# Altium schematic sheet Driver.SchDoc
size A4; SheetNumber: 1; SheetTotal: 3
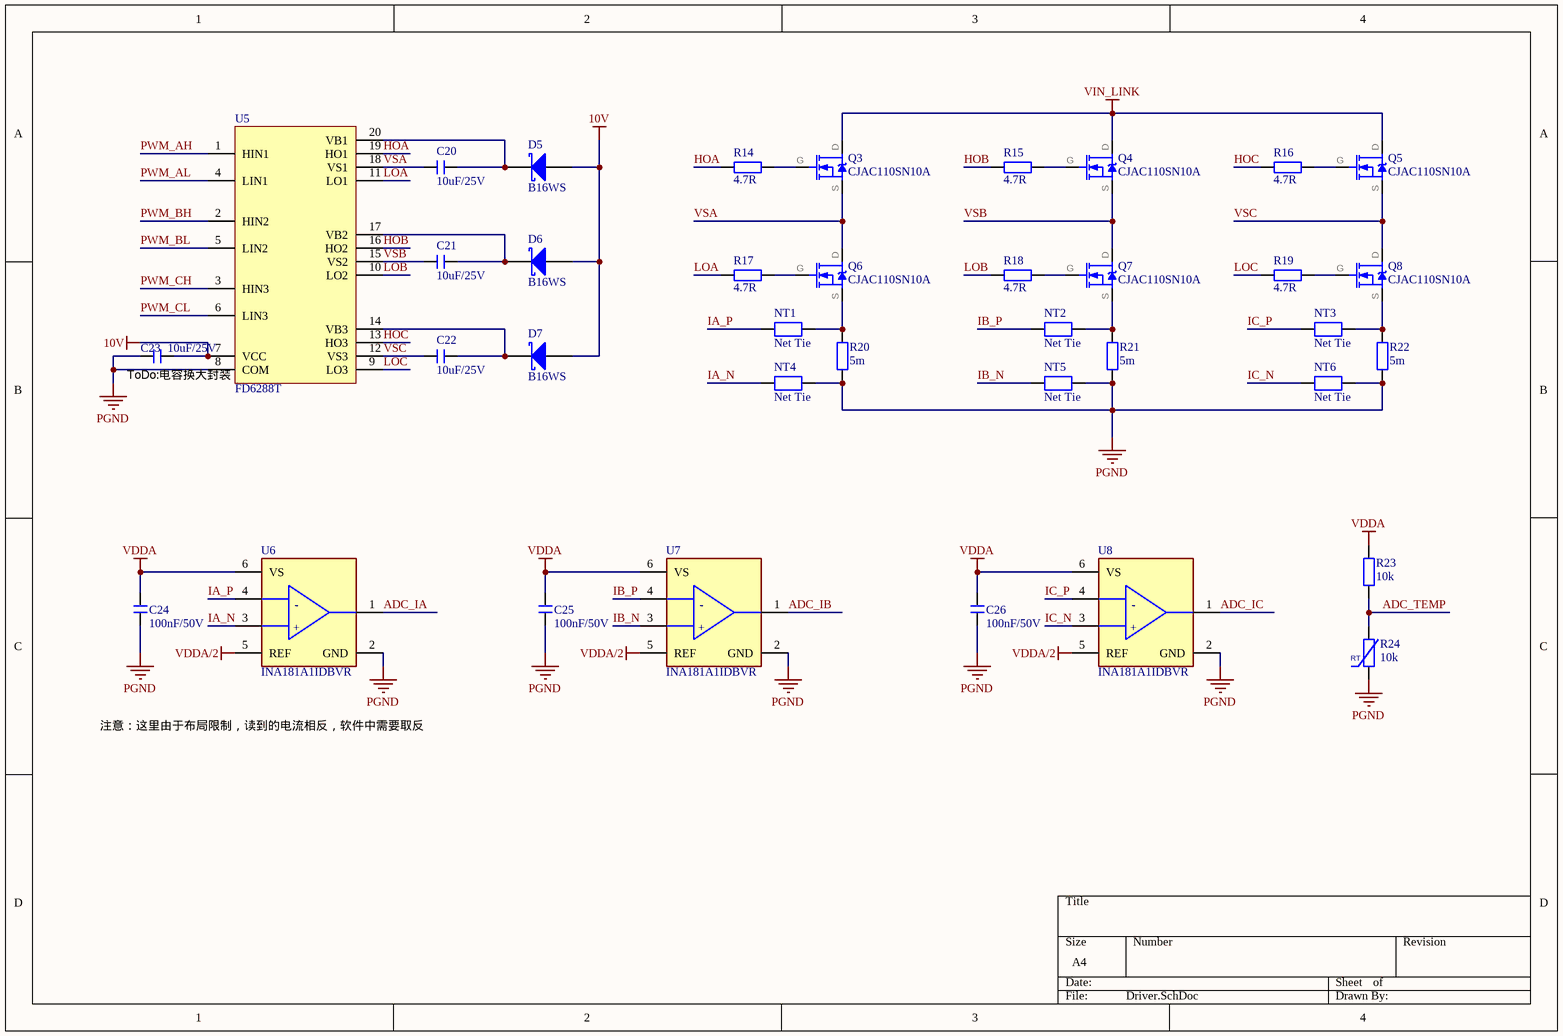
[diagram p0: Driver.SchDoc]

## Parts
C20  10uF/25V  [Capacitor_0603_SMD]
C21  10uF/25V  [Capacitor_0603_SMD]
C22  10uF/25V  [Capacitor_0603_SMD]
C23  10uF/25V  [Capacitor_0603_SMD]
C24  100nF/50V  [Capacitor_0402_SMD]
C25  100nF/50V  [Capacitor_0402_SMD]
C26  100nF/50V  [Capacitor_0402_SMD]
D5  B16WS  [SOD-323]
D6  B16WS  [SOD-323]
D7  B16WS  [SOD-323]
NT1  Net Tie  [Net Tie 10mil]  (net tie, no BOM)
NT2  Net Tie  [Net Tie 10mil]  (net tie, no BOM)
NT3  Net Tie  [Net Tie 10mil]  (net tie, no BOM)
NT4  Net Tie  [Net Tie 10mil]  (net tie, no BOM)
NT5  Net Tie  [Net Tie 10mil]  (net tie, no BOM)
NT6  Net Tie  [Net Tie 10mil]  (net tie, no BOM)
Q3  CJAC110SN10A  [PDFNWB5×6-8L]
Q4  CJAC110SN10A  [PDFNWB5×6-8L]
Q5  CJAC110SN10A  [PDFNWB5×6-8L]
Q6  CJAC110SN10A  [PDFNWB5×6-8L]
Q7  CJAC110SN10A  [PDFNWB5×6-8L]
Q8  CJAC110SN10A  [PDFNWB5×6-8L]
R14  4.7R  [Resistor_0603_SMD]
R15  4.7R  [Resistor_0603_SMD]
R16  4.7R  [Resistor_0603_SMD]
R17  4.7R  [Resistor_0603_SMD]
R18  4.7R  [Resistor_0603_SMD]
R19  4.7R  [Resistor_0603_SMD]
R20  5m  [Resistor_2512_SMD]
R21  5m  [Resistor_2512_SMD]
R22  5m  [Resistor_2512_SMD]
R23  10k  [Resistor_0402_SMD]
R24  10k  [Resistor_0402_SMD]
U5  FD6288T  [TSSOP20_L]
U6  INA181A1IDBVR  [FP-DBV0006A-IPC_A]
U7  INA181A1IDBVR  [FP-DBV0006A-IPC_A]
U8  INA181A1IDBVR  [FP-DBV0006A-IPC_A]

## Nets
10V: C23.2 D5.1(A) D6.1(A) D7.1(A) U5.7(VCC)
PGND: C23.1 C24.1 C25.1 C26.1 NT4.2 NT5.2 NT6.2 R20.1 R21.1 R22.1 R24.1 U5.8(COM) U6.2(GND) U7.2(GND) U8.2(GND)
VDDA: C24.2 C25.2 C26.2 R23.2 U6.6(VS) U7.6(VS) U8.6(VS)
VDDA/2: U6.5(REF) U7.5(REF) U8.5(REF)
VIN_LINK: Q3.D Q4.D Q5.D
ADC_IA: U6.1(OUT)
ADC_IB: U7.1(OUT)
ADC_IC: U8.1(OUT)
ADC_TEMP: R23.1 R24.2
HOA: R14.2 U5.19(HO1)
HOB: R15.2 U5.16(HO2)
HOC: R16.2 U5.13(HO3)
IA_N: NT4.1 U6.3(IN+)
IA_P: NT1.1 U6.4(IN-)
IB_N: NT5.1 U7.3(IN+)
IB_P: NT2.1 U7.4(IN-)
IC_N: NT6.1 U8.3(IN+)
IC_P: NT3.1 U8.4(IN-)
LOA: R17.2 U5.11(LO1)
LOB: R18.2 U5.10(LO2)
LOC: R19.2 U5.9(LO3)
PWM_AH: U5.1(HIN1)
PWM_AL: U5.4(LIN1)
PWM_BH: U5.2(HIN2)
PWM_BL: U5.5(LIN2)
PWM_CH: U5.3(HIN3)
PWM_CL: U5.6(LIN3)
VSA: C20.1 Q3.S Q6.D U5.18(VS1)
VSB: C21.1 Q4.S Q7.D U5.15(VS2)
VSC: C22.1 Q5.S Q8.D U5.12(VS3)
NetC20_2: C20.2 D5.2(K) U5.20(VB1)
NetC21_2: C21.2 D6.2(K) U5.17(VB2)
NetC22_2: C22.2 D7.2(K) U5.14(VB3)
NetNT1_2: NT1.2 Q6.S R20.2
NetNT2_2: NT2.2 Q7.S R21.2
NetNT3_2: NT3.2 Q8.S R22.2
NetQ3_G: Q3.G R14.1
NetQ4_G: Q4.G R15.1
NetQ5_G: Q5.G R16.1
NetQ6_G: Q6.G R17.1
NetQ7_G: Q7.G R18.1
NetQ8_G: Q8.G R19.1

## Notes on the sheet
- (near C23) ToDo:电容换大封装
- 注意：这里由于布局限制，读到的电流相反，软件中需要取反
- (in symbol CMP-04895-000055-1) -; +

## Library data of the parts
C20-C26 = C: 无极性贴片电容; 版权归属: 源创客; BOM名称: 无极性贴片电容; 学习资源: www.ooocke.com
D5-D7 = SS14: 肖特基二极管; 属性: 40V/1A; 联系卖家，免费查找封装: 唯一出售店铺网址https://shop463601444.taobao.com; BOM名称: 肖特基二极管
Q3-Q8 = CJAC110SN10A: 110A 3.4mΩ@10V N-Channel Power MOSFET
R14-R22 = R: 贴片电阻; 版权归属: 源创客; BOM名称: 贴片电阻; 学习资源: www.ooocke.com
R23 = R: 贴片电阻; 联系卖家，免费查找封装: 唯一出售店铺网址https://shop463601444.taobao.com; BOM名称: 贴片电阻
R24 = RT: 热敏电阻; BOM名称: 压敏电阻; 联系卖家，免费查找封装: 唯一出售店铺网址https://shop463601444.taobao.com
U5 = FD6288T: 三相250V栅极驱动器
U6-U8 = CMP-04895-000055-1: IC CURR SENSE 1 CIRCUIT SOT23-6; Manufacturer: Texas Instruments; Input Offset Voltage: 0.1mV; Min Supply Voltage: 2.7V; Max Junction Temp: +150°C; Voltage Gain: 0.02V/mV; Number Of Channels: 1; Standoff Height: 0mm; Input Bias Current: 75uA; Nominal Supply Current: 195uA; Bandwidth: 350kHz; Output Current Per Channel: 8mA; Max Supply Voltage: 5.5V; Device Class L1: Integrated Circuits (ICs); Ambient Temperature Range High: +125°C; Device Class L3: Instrumentation; Temperature: -40°C to +125°C; ComponentLink2Description: Datasheet; RoHS: TRUE; Category: IC; Manufacturer Part Number: INA181A1IDBVR; Mouser Description: 26V bi-directional current sense amplifier for cost-sensitive systems 6-SOT-23 -40 to 125; Package: DBV0006A; Automotive: No; Height: 1.45mm; Temperature Range Low: -40°C; Lead Free: Yes; Device Class L2: Linear ICs; Digikey Description: IC CURR SENSE 1 CIRCUIT SOT23-6; ComponentLink2URL: http://www.ti.com/lit/ds/symlink/ina181.pdf; Ambient Temperature Range Low: -40°C; Octopart: https://octopart.com/ina181a1idbvr-texas+instruments-81856289; Temperature Range High: +125°C